# Altium schematic sheet 2 LTE 1.SchDoc
size 594 x 420 mm; SheetNumber: 3; SheetTotal: 9
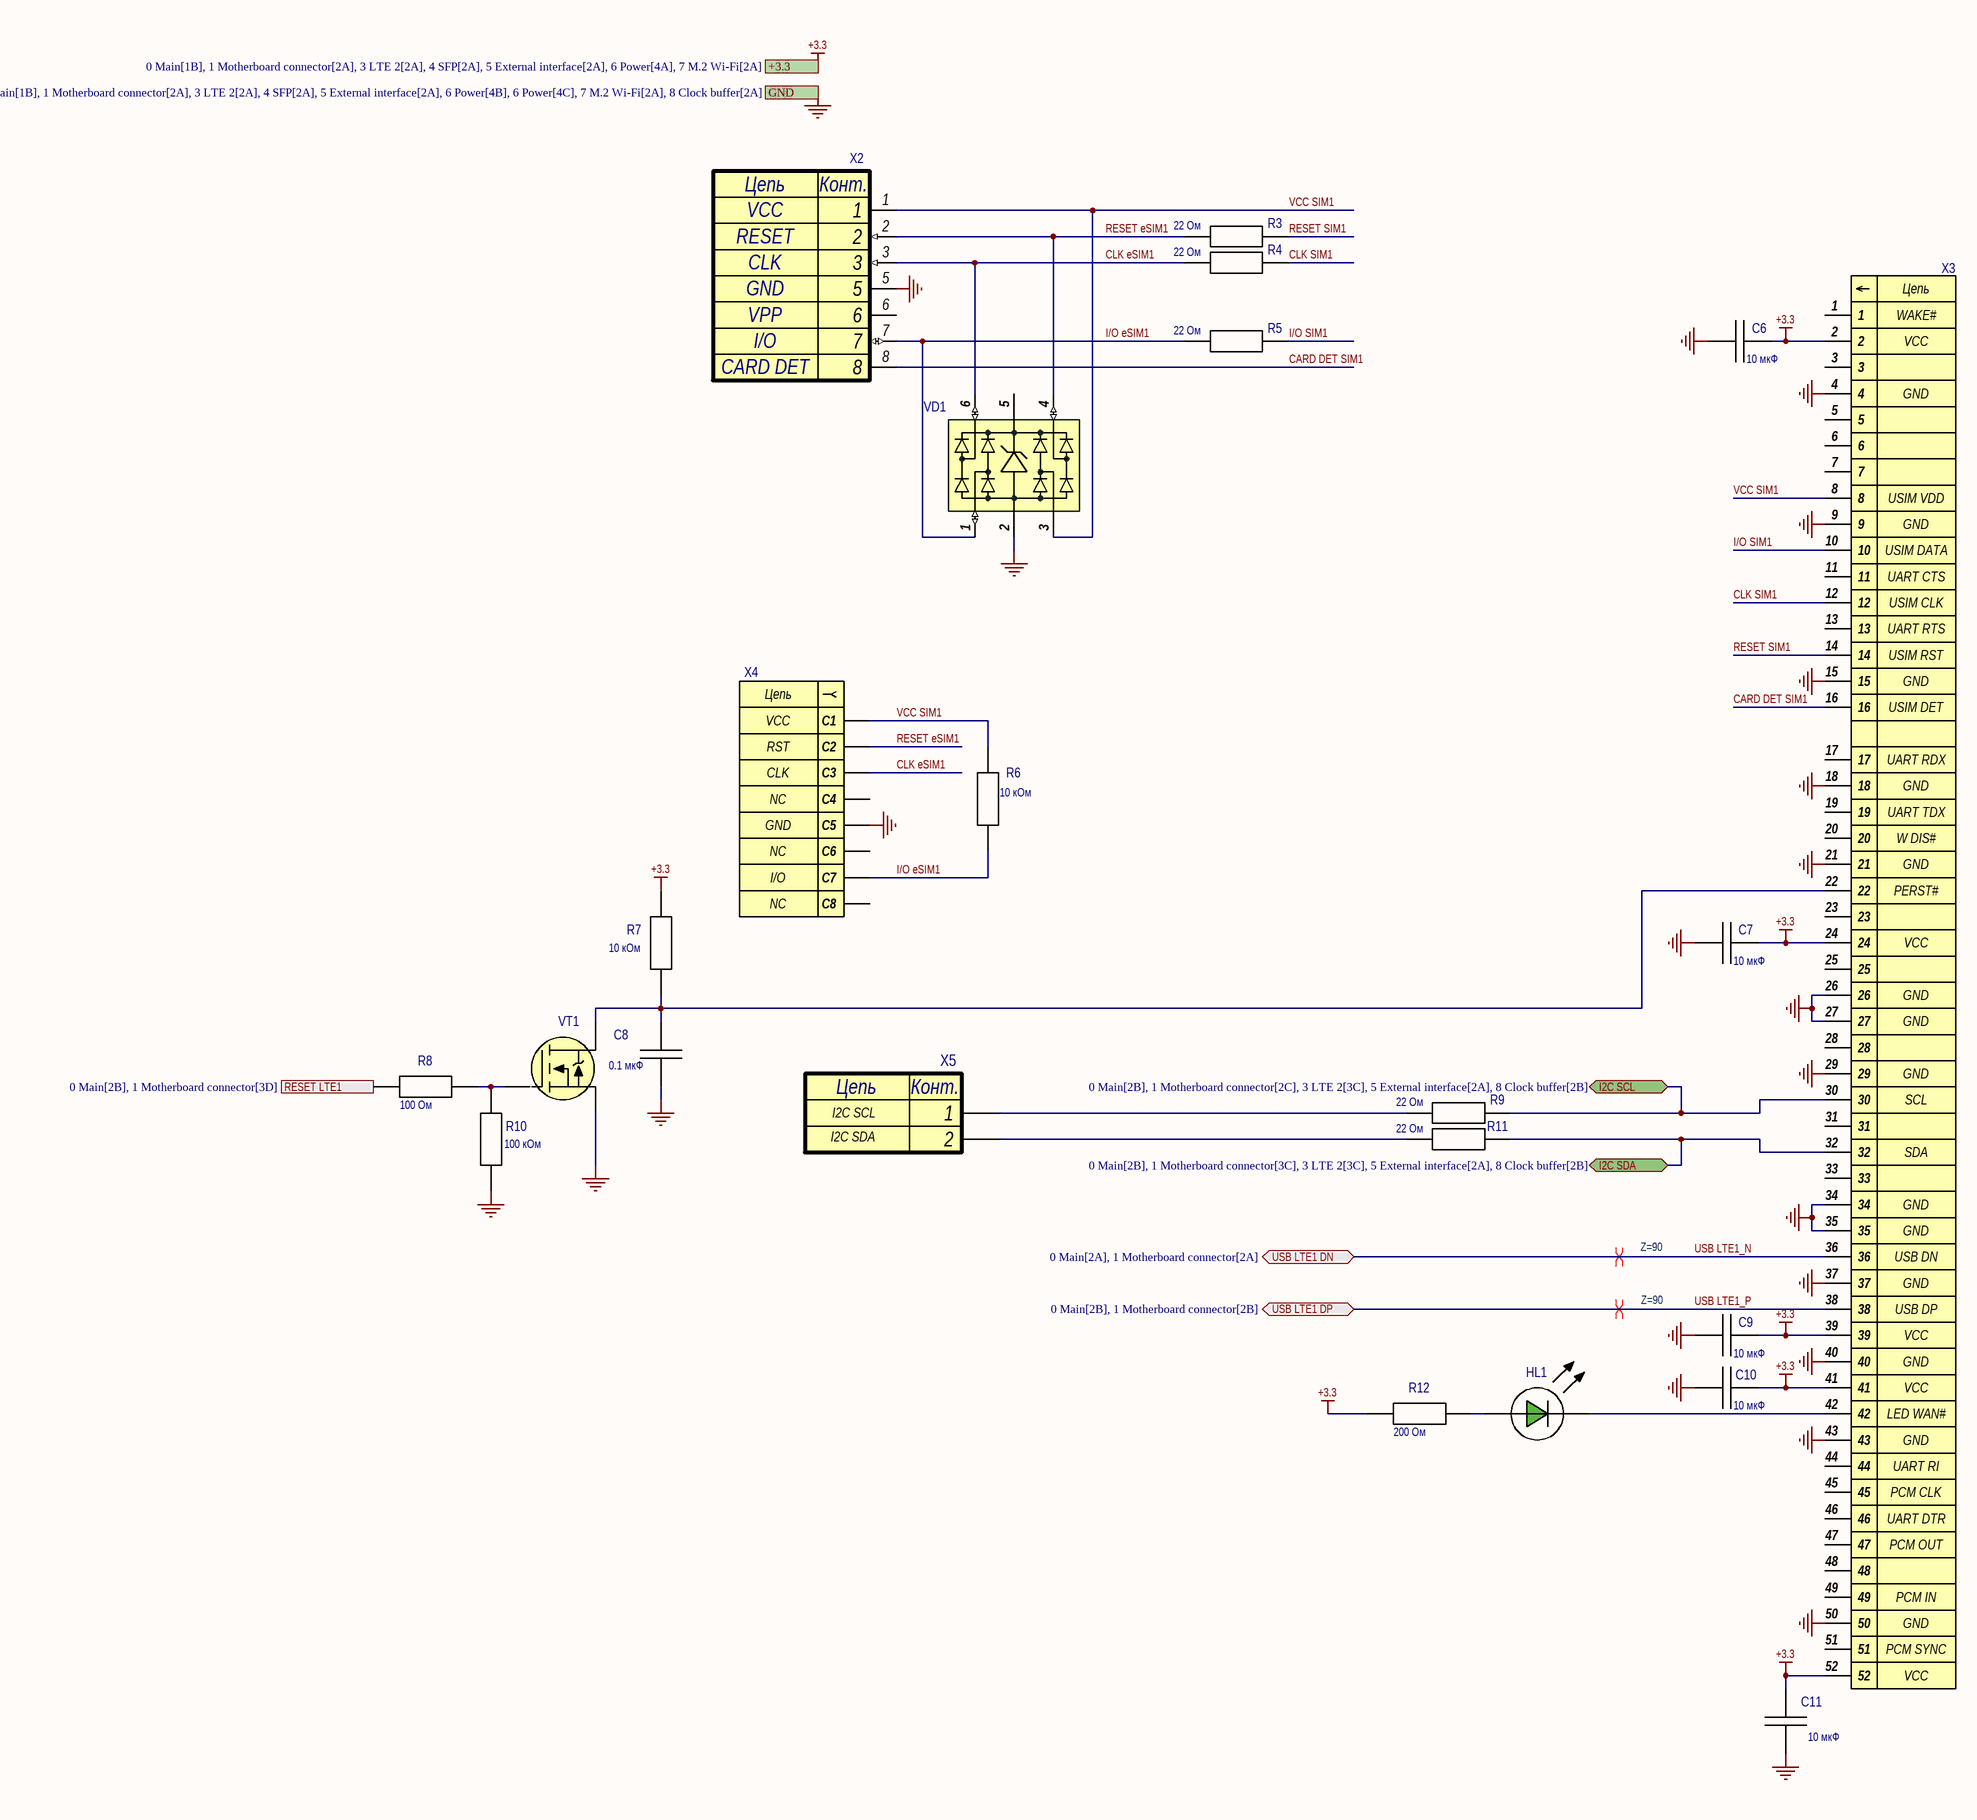
[diagram p0: 2 LTE 1.SchDoc]

## Parts
C6  value 10 мкФ  [CAP_0805]
C7  value 10 мкФ  [CAP_0805]
C8  value 0.1 мкФ  [CAP_0402]
C9  value 10 мкФ  [CAP_0805]
C10  value 10 мкФ  [CAP_0805]
C11  value 10 мкФ  [CAP_0805]
HL1  APHHS1005CGCK  [LED_0402_GREEN]  (value not drawn)
R3  value 22 Ом  [RES_0402]  (hidden comment: STD_RES)
R4  value 22 Ом  [RES_0402]  (hidden comment: STD_RES)
R5  value 22 Ом  [RES_0402]  (hidden comment: STD_RES)
R6  value 10 кОм  [RES_0402]  (hidden comment: STD_RES)
R7  value 10 кОм  [RES_0402]  (hidden comment: STD_RES)
R8  value 100 Ом  [RES_0402]  (hidden comment: STD_RES)
R9  value 22 Ом  [RES_0402]  (hidden comment: STD_RES)
R10  value 100 кОм  [RES_0402]  (hidden comment: STD_RES)
R11  value 22 Ом  [RES_0402]  (hidden comment: STD_RES)
R12  value 200 Ом  [RES_0402]  (hidden comment: STD_RES)
VD1  SRV05-4  [SOT-23-6]  (value not drawn)
VT1  2N7002P  [SOT-23-3]  (value not drawn)
X2  Sim холдер с детектированием sim-card  и выдвижным держателем SMN-327-KT1B  [SMN-328-ACP7]  (value not drawn)
X3  2041262-1  [2041262-1]  (value not drawn)
X4  SIM_MFF2  [SIM_MFF2]  (value not drawn)
X5  STD_CON2  [PLS-2]  (value not drawn)

## Ports
+3.3 (see 0 Main[1B], 1 Motherboard connector[2A], 3 LTE 2[2A], 4 SFP[2A], 5 External interface[2A], 6 Power[4A], 7 M.2 Wi-Fi[2A]), GND (see 0 Main[1B], 1 Motherboard connector[2A], 3 LTE 2[2A], 4 SFP[2A], 5 External interface[2A], 6 Power[4B], 6 Power[4C], 7 M.2 Wi-Fi[2A], 8 Clock buffer[2A]), I2C SCL (bidir, see 0 Main[2B], 1 Motherboard connector[2C], 3 LTE 2[3C], 5 External interface[2A], 8 Clock buffer[2B]), I2C SDA (bidir, see 0 Main[2B], 1 Motherboard connector[3C], 3 LTE 2[3C], 5 External interface[2A], 8 Clock buffer[2B]), RESET LTE1 (see 0 Main[2B], 1 Motherboard connector[3D]), USB LTE1 DN (bidir, see 0 Main[2A], 1 Motherboard connector[2A]), USB LTE1 DP (bidir, see 0 Main[2B], 1 Motherboard connector[2B])

## Nets
+3.3: C6.1 C7.1 C9.1 C10.1 C11.1 R7.2 R12.1 X3.2 X3.24 X3.39 X3.41 X3.52 ; port +3.3
GND: C6.2 C7.2 C8.2 C9.2 C10.2 C11.2 R10.1 VD1.2 VT1.2(S) X2.5 X3.4 X3.9 X3.15 X3.18 X3.21 X3.26 X3.27 X3.29 X3.34 X3.35 X3.37 X3.40 X3.43 X3.50 X4.C5 ; port GND
CARD DET SIM1: X2.8 X3.16
CLK eSIM1: R4.1 VD1.6 X2.3 X4.C3
CLK SIM1: R4.2 X3.12
I2C SCL: R9.2 X3.30 ; port I2C SCL
I2C SDA: R11.2 X3.32 ; port I2C SDA
I/O eSIM1: R5.1 R6.1 VD1.1 X2.7 X4.C7
I/O SIM1: R5.2 X3.10
RESET eSIM1: R3.1 VD1.4 X2.2 X4.C2
RESET LTE1: R8.1 ; port RESET LTE1
RESET SIM1: R3.2 X3.14
USB LTE1_N: X3.36 ; port USB LTE1 DN
USB LTE1_P: X3.38 ; port USB LTE1 DP
VCC SIM1: R6.2 VD1.3 X2.1 X3.8 X4.C1
NetC8_1: C8.1 R7.1 VT1.3(D) X3.22
NetHL1_1: HL1.1(A) R12.2
NetHL1_2: HL1.2(K) X3.42
NetR8_2: R8.2 R10.2 VT1.1(G)
NetR9_1: R9.1 X5.1
NetR11_1: R11.1 X5.2

Not connected (* = marked no-connect by the designer): VD1 5; X2 6; X3 1 3 5 6 7 11 13 17 19 20 23 25 28 31 33 44 45 46 47 48 49 51; X4 C4 C6 C8

## Layout directives
differential pair; differential pair class Z=90: USB LTE1_N, USB LTE1_P

## Notes on the sheet
- I2C SDA
- I2C SCL
- Перв. примен.
- Справ. №
- Подп. и дата
- Инв. № дубл.
- Взам. инв. №
- Инв. № подл.
- Изм.
- Лист
- № докум.
- Подп.
- Дата
- 2.106-A2
- Копировал
- Формат А2
- (in symbol 2041262-1) Цепь; WAKE#; VCC; GND; USIM VDD; USIM DATA; UART CTS; USIM CLK; UART RTS; USIM RST; USIM DET; UART RDX; UART TDX; W DIS#; PERST#; SCL; SDA; USB DN; USB DP; LED WAN#; UART RI; PCM CLK; UART DTR; PCM OUT; PCM IN; PCM SYNC
- (in symbol PLS-2) Цепь; Конт.
- (in symbol SIM_MFF2) Цепь; VCC; RST; CLK; NC; GND; I/O
- (in symbol SMN-328-ACP7) Цепь; Конт.; VCC; RESET; CLK; GND; VPP; I/O; CARD DET

## Library data of the parts
C6 C7 C9-C11 = GRM21BR61C106KE15L: Конденсатор CHIP-0805 10 мкФ 16 В 10% X5R; Manufacturer: MURATA; ID: 121; Напряжение: 16 В; Температура: -55...+85°C; Autor: Цислав А.Н.; PartNumber: GRM21BR61C106KE15L; Type: CHIP-0805; Tolerance: 10%; Диэлектрик: X5R; Data: 09-05-2013
C8 = CC0402KRX7R9BB104: Конденсатор CHIP-0402 0.1 мкФ 50 В 10% X7R; Manufacturer: YAGEO; ID: 357; Напряжение: 50 В; Температура: -55...+85°C; Autor: Admin; PartNumber: CC0402KRX7R9BB104; Type: CHIP-0402; Tolerance: 10%; Диэлектрик: X7R; Data: 10-04-2024
HL1 = APHHS1005CGCK: Диод Kingbright 2 В 20 мА; ID: 15; Type: LED; U_direct: 2 В; Current: 20 мА; Температура: -40...+85°C; Autor: Цислав А.Н.; PartNumber: APHHS1005CGCK; Manufacturer: Kingbright; Data: 04-30-2014
R3-R5 R9 R11 = RC0402FR-0722RL: Резистор CHIP-0402 22 Ом 1%; Manufacturer: YAGEO; ID: 272; ТКС: 100 ppm/K; Температура: -55...+155°C; Autor: Цислав А.Н.; PartNumber: RC0402FR-0722RL; Type: CHIP-0402; Tolerance: 1%; Data: 02-03-2014
R6 R7 = RC0402JR-0710KL: Резистор CHIP-0402 10 кОм 5%; Manufacturer: YAGEO; ID: 413; ТКС: 100 ppm/K; Температура: -55...+155°C; Autor: Цислав А.Н.; PartNumber: RC0402JR-0710KL; Type: CHIP-0402; Tolerance: 5%; Data: 02-03-2014
R8 = RC0402JR-07100RL: Резистор CHIP-0402 100 Ом 5%; Manufacturer: YAGEO; ID: 299; ТКС: 100 ppm/K; Температура: -55...+155°C; Autor: Цислав А.Н.; PartNumber: RC0402JR-07100RL; Type: CHIP-0402; Tolerance: 5%; Data: 02-03-2014
R10 = RC0402JR-07100KL: Резистор CHIP-0402 100 кОм 5%; Manufacturer: YAGEO; ID: 455; ТКС: 100 ppm/K; Температура: -55...+155°C; Autor: Цислав А.Н.; PartNumber: RC0402JR-07100KL; Type: CHIP-0402; Tolerance: 5%; Data: 02-03-2014
R12 = RC0402JR-07200RL: Резистор CHIP-0402 200 Ом 5%; Manufacturer: YAGEO; ID: 311; ТКС: 100 ppm/K; Температура: -55...+155°C; Autor: Цислав А.Н.; PartNumber: RC0402JR-07200RL; Type: CHIP-0402; Tolerance: 5%; Data: 02-03-2014
VD1 = SRV05-4: Диод SEMTECH 1.2 В 12 А; ID: 91; Type: Diode TVS; U_direct: 1.2 В; U_reverse: 5 В; Current: 12 А; Температура: -55...+125°C; Autor: Admin; PartNumber: SRV05-4; Manufacturer: SEMTECH; Data: 01-10-2018
VT1 = 2N7002P: Микросхема NXP  N-channel Trench MOSFET; ID: 321; Type: MOSFET N-Channel; Voltage: 60В; Current: 300 мА; Температура: -40...+85°C; Autor: Admin; PartNumber: 2N7002P; Value: N-channel Trench MOSFET; Manufacturer: NXP; Data: 05-24-2016
X2 = SMN-328-ACP7: Разъем XunPu SIM; ID: 370; Contact: 8; Autor: Admin; PartNumber: SMN-328-ACP7; Type: SIM; Pitch: -; Mounting: Поверхностный; Current: -; Manufacturer: XunPu; Data: 04-25-2024
X3 = 2041262-1: Разъем TE PCI-E; ID: 335; Contact: 52; Pitch: 0.8 мм; Current: 100 мА; Autor: Admin; PartNumber: 2041262-1; Type: PCI-E; Mounting: Поверхностный; Manufacturer: TE; Data: 11-21-2023
X4 = SIM_MFF2: Разъем E - SIM; Manufacturer: E -; ID: 259; Contact: 8; Pitch: 1.27 мм; Current: 100 мА; Autor: Admin; PartNumber: SIM_MFF2; Type: SIM; Mounting: Поверхностный; Data: 06-14-2019
X5 = PLS-2: Разъем NoName PLS; ID: 2; Pitch: 2.54 мм; Current: 2 А; Autor: Admin; PartNumber: PLS-2; Type: PLS; Contact: 2; Mounting: Сквозной; Manufacturer: NoName; Data: 09-04-2013